# EAGLE design SevenSegmentDisplay (EAGLE 6.5.0)
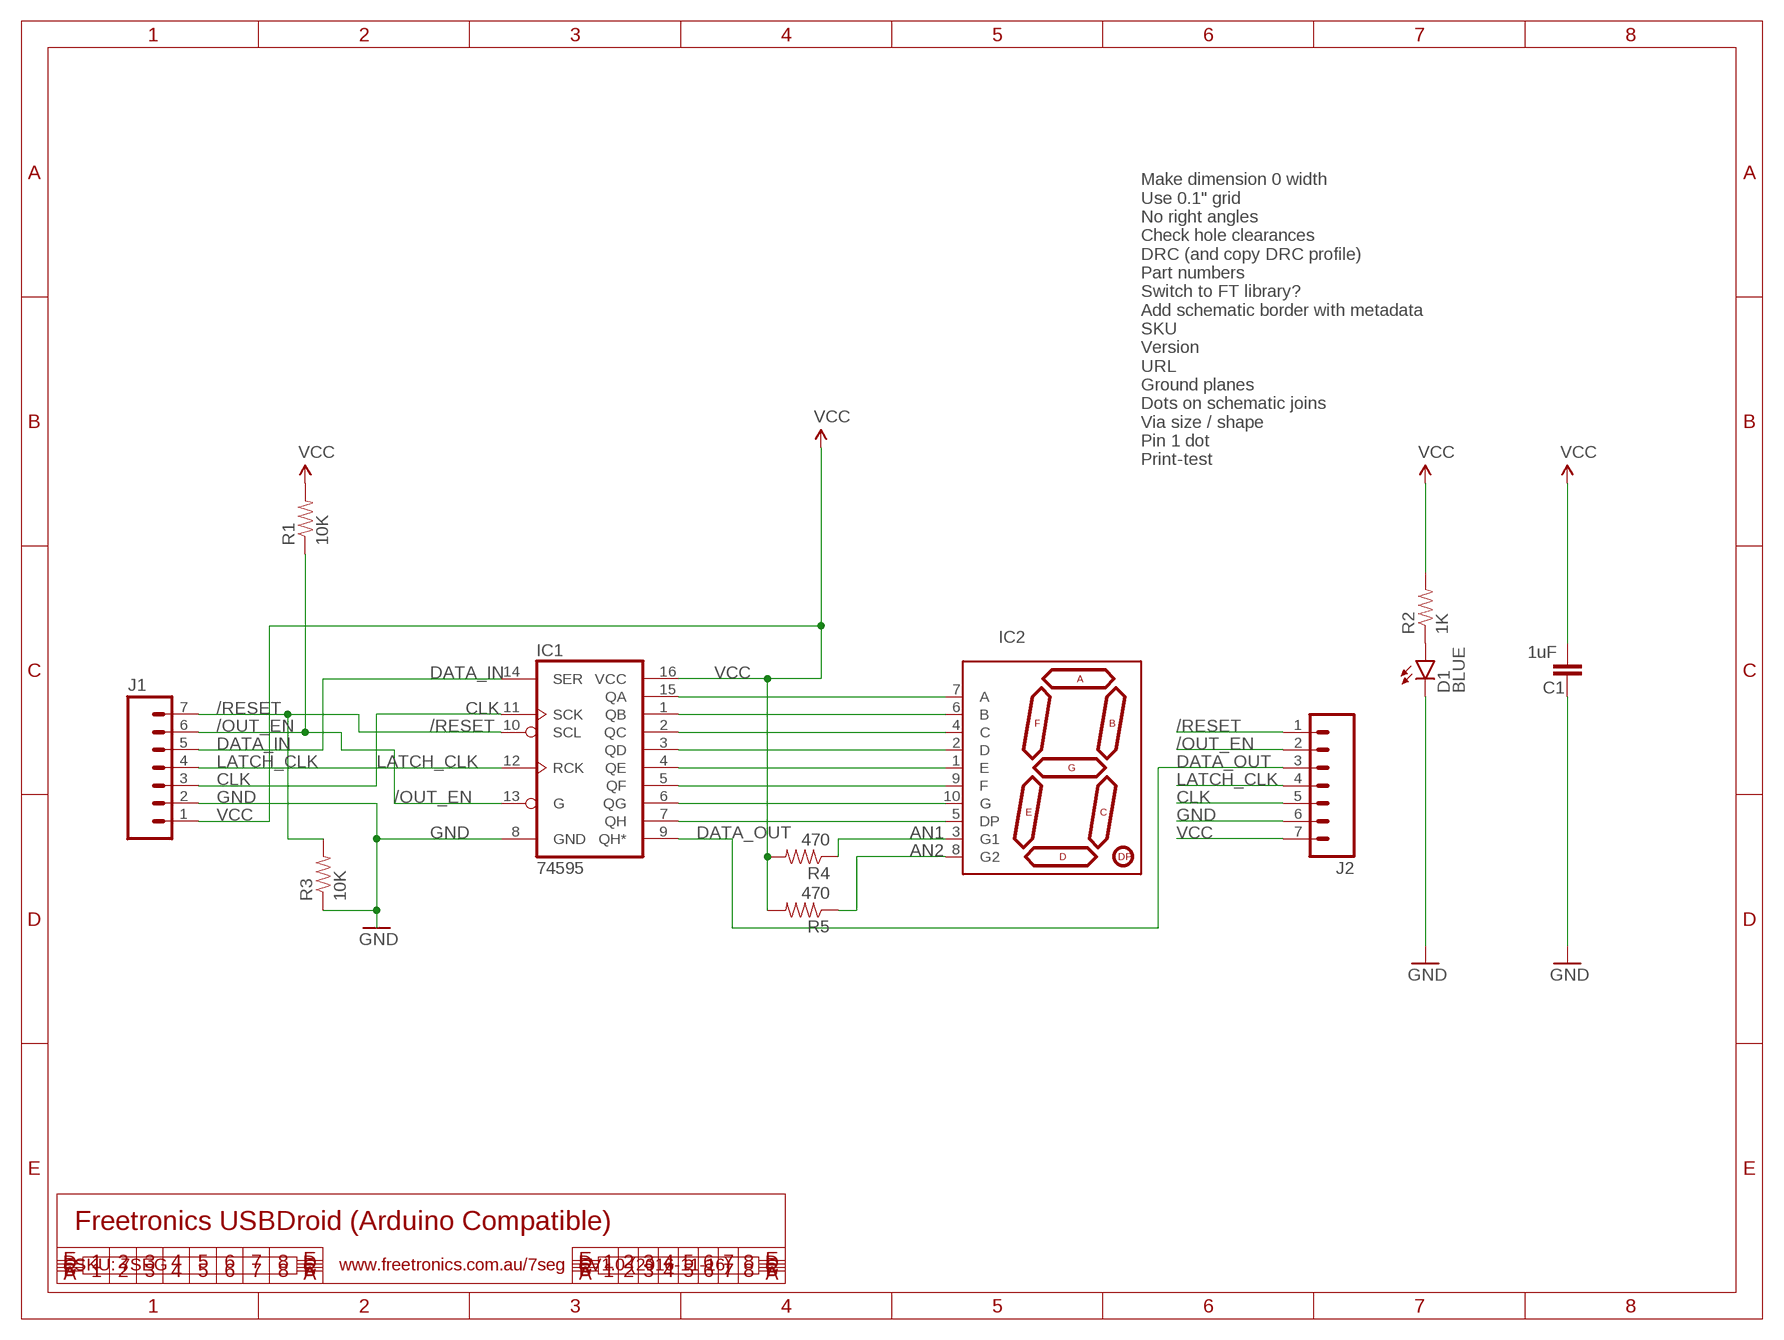
[diagram p0: schematic, sheet 1]

## Parts
C1  1uF  CAP0603-CAP  [0603-CAP]
D1  BLUE  LED-BLUE0603  [LED-0603]
IC1  74595  [TSSOP16]
IC2  7-SEGMENT-DISPLAYPTH  [7-SEGMENT-DISPLAY]
J1  M07  [1X07]
J2  M07  [1X07]
R1  10K  RESISTOR0603-RES  [0603-RES]
R2  1K  RESISTOR0603-RES  [0603-RES]
R3  10K  RESISTOR0603  [0603-RES]
R4  470  RESISTOR0603  [0603-RES]
R5  470  RESISTOR0603  [0603-RES]

## Nets
/OUT_EN: IC1.13(G) J1.6 J2.2 R1.1
/RESET: IC1.10(SCL) J1.7 J2.1 R3.2
AN1: IC2.3(G1) R4.1
AN2: IC2.8(G2) R5.1
CLK: IC1.11(SCK) J1.3 J2.5
DATA_IN: IC1.14(SER) J1.5
DATA_OUT: IC1.9(QH*) J2.3
GND: C1.1 D1.C IC1.8(GND) J1.2 J2.6 R3.1
LATCH_CLK: IC1.12(RCK) J1.4 J2.4
N$1: IC1.15(QA) IC2.7(A)
N$3: IC1.1(QB) IC2.6(B)
N$4: IC1.2(QC) IC2.4(C)
N$5: D1.A R2.1
N$6: IC1.3(QD) IC2.2(D)
N$7: IC1.4(QE) IC2.1(E)
N$8: IC1.5(QF) IC2.9(F)
N$9: IC1.6(QG) IC2.10(G)
N$10: IC1.7(QH) IC2.5(DP)
VCC: C1.2 IC1.16(VCC) J1.1 J2.7 R1.2 R2.2 R4.2 R5.2

## Notes on the sheet
- Make dimension 0 width
  Use 0.1" grid
  No right angles
  Check hole clearances
  DRC (and copy DRC profile)
  Part numbers
  Switch to FT library?
  Add schematic border with metadata
  SKU
  Version
  URL
  Ground planes
  Dots on schematic joins
  Via size / shape
  Pin 1 dot
  Print-test
- IC2
- Freetronics USBDroid (Arduino Compatible)
- SKU: 7SEG | www.freetronics.com.au/7seg | V1.0 (2016-11-16)

## Library data of the parts
C1 = SparkFun-Capacitors:CAP: Capacitor Standard 0603 ceramic capacitor, and 0.1" leaded capacitor.
D1 = SparkFun-LED:LED-BLUE: Blue LEDs for production use Various blue LEDs stocked by SparkFun production 0603 - DIO-08575 Rebel - DIO-09553 1206 - DIO-09911; PROD_ID: DIO-08575
IC1 = SparkFun-DigitalIC:74*595: 8-bit SHIFT REGISTER, output latch
IC2 = SparkFun-Displays:7-SEGMENT-DISPLAY
J1 J2 = SparkFun-Connectors:M07: Header 7 Standard 7-pin 0.1" header. Use with straight break away headers (SKU : PRT-00116), right angle break away headers (PRT-00553), swiss pins (PRT-00743), machine pins (PRT-00117), and female headers (PRT-00115). NOTES ON THE VARIANTS LOCK and LOCK_LONGPADS... This footprint was designed to help hold the alignment of a through-hole component (i.e. 7-pin header) while soldering it into place. You may notice that each hole has been shifted either up or down by 0.005 of an inch from it's more standard position (which is usually a perfectly straight line). This slight alteration caused the pins (the squares in the middle) to touch the edges of the holes. Because they are alternating, it causes a "brace" to hold the header in place. 0.005 has proven to be the perfect amount of "off-center" position when using our standard breakaway headers. Although looks a little odd when you look at the bare footprint, once you have a header in there, the alteration is very hard to notice. Also, if you push a header all the way into place, it is covered up entirely on the bottom side. This idea of altering the position of holes to aid alignment will be further integrated into the Sparkfun Library for other footprints. It can help hold any component with 3 or more connection pins.
R1 R2 = SparkFun-Passives:RESISTOR: Resistor Basic schematic elements and footprints for 0603, 1206, and PTH resistors.
R3-R5 = SparkFun-Resistors:RESISTOR: Resistor Basic schematic elements and footprints for 0603, 1206, and PTH resistors.

## Board
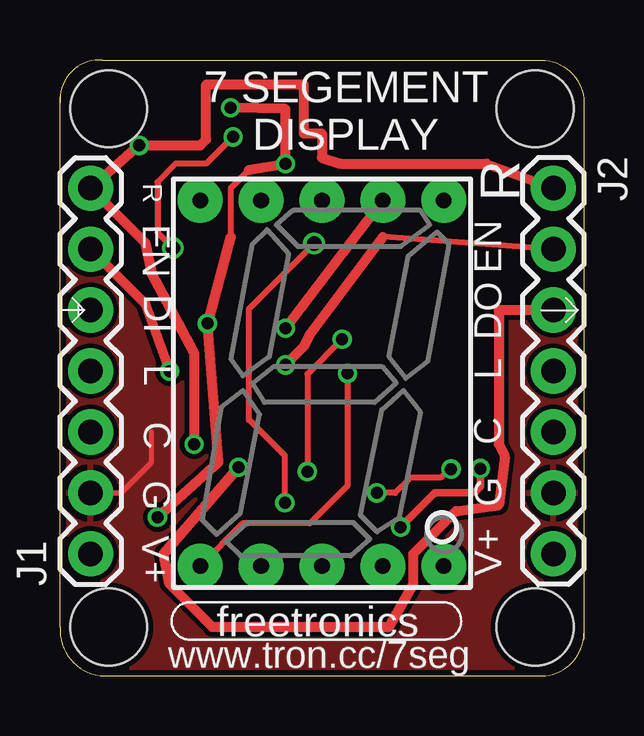
[diagram p1: board, top side]
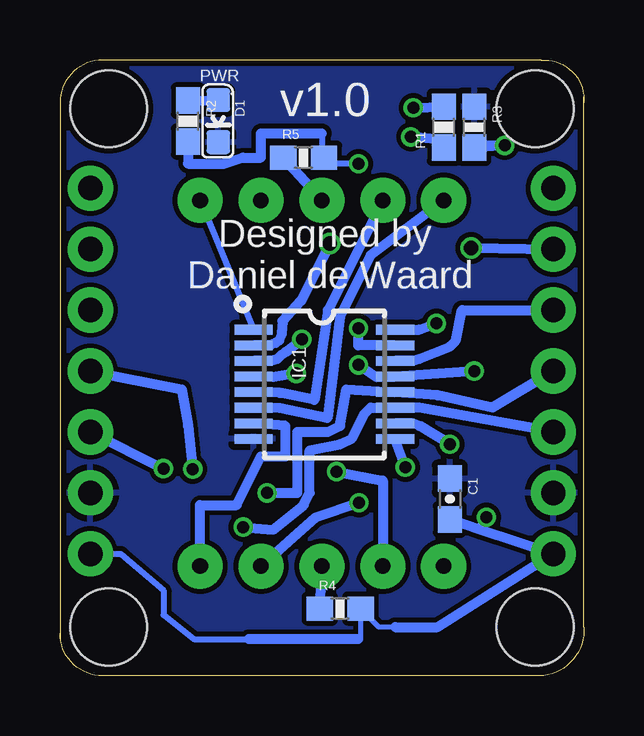
[diagram p2: board, bottom side, seen from below]

Size 21.85 x 25.66 mm. Coordinates in mm from the lower left corner, seen from the top.
Outline: 0,24.13 0,2.04 arc98 2.04,0 20.07,0 arc90 21.85,1.78
Outline: 21.85,1.53 21.85,23.88 arc90 20.07,25.66 1.78,25.66 arc99 0,23.88
Copper layers (1*16): Top 0.035mm / dielectric 1.5mm / Bottom 0.035mm
Design rules "dirt_cheap_dirty_boards.v1 *": minimum track width 5mil, minimum drill 12mil, track to track 8mil, track to pad 8mil, pad to pad 8mil, via to via 8mil, smd to smd 0mil, copper to edge 10mil, drill to drill 10mil, minimum pad ring 10mil, minimum via ring 6mil, stop-mask expansion 2mil, vias tented up to drill 25mil, thermal gap 10mil
Holes 3.2 mm at 2.04,2.04 19.82,2.04 2.04,23.63 19.82,23.63

### Footprints (pad centres in the part's own frame; a part is rotated, then mirrored left to right if it is on the bottom)
0603-CAP = smd 1.1 x 1: 1 -0.85,0; 2 0.85,0
LED-0603 = smd 1 x 1: A 0,-0.877; C 0,0.877
TSSOP16 = smd 0.4 x 1.6: 1 -2.225,-2.85; 2 -1.575,-2.85; 3 -0.925,-2.85; 4 -0.275,-2.85; 5 0.375,-2.85; 6 1.025,-2.85; 7 1.675,-2.85; 8 2.325,-2.85; 9 2.325,3.05; 10 1.675,3.05; 11 1.025,3.05; 12 0.375,3.05; 13 -0.275,3.05; 14 -0.925,3.05; 15 -1.575,3.05; 16 -2.225,3.05
7-SEGMENT-DISPLAY = drill 0.65 pad 1.88: 1 -5.08,-7.62; 2 -2.54,-7.62; 3 0,-7.62; 4 2.54,-7.62; 5 5.08,-7.62; 6 5.08,7.62; 7 2.54,7.62; 8 0,7.62; 9 -2.54,7.62; 10 -5.08,7.62
1X07 = drill 1.016 pad 1.88: 1 0,0; 2 2.54,0; 3 5.08,0; 4 7.62,0; 5 10.16,0; 6 12.7,0; 7 15.24,0
0603-RES = smd 1.1 x 1: 1 -0.85,0; 2 0.85,0

### Placement (x,y rotation side)
C1  5.59,7.37 270 bottom
D1  15.24,23.12 180 bottom
IC1  10.93,12.2 270 bottom
IC2  10.93,12.2 0 top
J1  1.27,5.08 90 top
J2  20.58,20.32 270 top
R1  5.85,22.86 90 bottom
R2  16.51,23.12 270 bottom
R3  4.58,22.86 270 bottom
R4  10.16,2.8 0 bottom
R5  11.69,21.59 0 bottom

### Tracks (layer width: path | path; a pad name or v marks a point on that pad's centre or on a via)
/OUT_EN  (via drill 0.5, 0.6)
  Top 0.254: J2.2 13.47,18.29 | v7.22,22.46 6.1,21.34 4.83,21.34 4.07,20.58 4.07,18.47 v4.7,17.83
  Top 0.406: J1.6 3.56,15.5 v4.58,12.7 | 13.47,18.29 10.42,14.23 10.16,13.72 v9.4,12.96
  Bottom 0.406: v4.58,12.7 IC1.13 8.64,12.45 v9.4,12.96 | R1.1 6.19,22.36 v7.22,22.46 | v4.7,17.83 J1.6
/RESET  (via drill 0.5)
  Top 0.406: v5.59,9.66 5.59,13.47 3.81,16.77 3.56,18.04 J1.7 v3.31,22.1 5.85,22.1 6.1,22.36 6.1,24.64 10.16,24.64 10.16,22.61 10.93,22.61 10.93,21.59 11.69,21.34 17.78,21.34 J2.1
  Bottom 0.406: v5.59,9.66 6.86,10.42 7.14,10.52 IC1.10 | v3.31,22.1 R3.2 4.58,22.1 v3.31,22.1
AN1
  Bottom 0.406: R4.1 IC2.3
AN2
  Bottom 0.406: IC2.8 R5.1
CLK  (via drill 0.5)
  Top 0.305: v17.53,8.64 17.53,7.88 17.28,7.62 15.63,7.62 v14.2,6.2
  Bottom 0.406: J1.3 6.86,11.18 IC1.11 8.89,11.18 9.15,10.93 9.66,9.91 10.16,9.66 11.43,9.4 11.43,7.62 11.69,7.12 12.96,6.1 v14.2,6.2 | J2.5 v17.53,8.64
DATA_IN
  Bottom 0.406: J1.5 5.08,15.24 5.34,13.97 5.59,13.72 6.86,13.21 7.12,13.14 IC1.14
DATA_OUT  (via drill 0.5)
  Top 0.406: v7.45,8.69 4.32,5.08 4.58,3.81 6.35,2.04 13.72,2.04 14.74,3.81 14.74,5.08 16.51,6.86 18.29,7.12 18.55,9.15 18.29,9.66 18.29,15.24 J2.3
  Bottom 0.406: v7.45,8.69 IC1.9
GND
  Top 0.203: J1.2 2.54,7.62 3.81,8.89 3.81,10.16
  pour Bottom: 0,26.67 0,0 22.86,0 22.86,26.67
  pour Top: 0,26.67 0,0 22.86,0 22.86,26.67
LATCH_CLK  (via drill 0.5)
  Top 0.254: v16.31,8.61 16.24,8.61 15.88,8.26 14.61,8.26 13.97,7.62 v13.21,7.62
  Bottom 0.406: J1.4 3.81,11.18 6.1,11.69 IC1.12 9.91,11.94 10.16,10.42 10.67,10.16 11.94,10.16 11.94,7.62 v13.21,7.62 | J2.4 16.77,11.94 16.51,10.42 v16.31,8.61
N$1  (via drill 0.5)
  Top 0.406: v9.4,14.48 IC2.7
  Bottom 0.406: IC1.15 9.4,13.77 v9.4,14.48
N$3
  Bottom 0.254: IC2.6 IC1.1
N$4  (via drill 0.5, 0.6)
  Top 0.254: v9.38,7.22 9.38,9.17 7.88,10.67 7.88,15.29 v10.6,18.01
  Bottom 0.406: IC2.4 11.18,6.61 v9.38,7.22 | v10.6,18.01 11.79,15.62 12.58,14.79 12.6,14.25 12.7,13.97 12.86,13.87 13.06,13.8 IC1.2
N$5
  Bottom 0.406: R2.1 D1.A
N$6  (via drill 0.5)
  Top 0.254: v11.76,14.02 10.32,12.58 v10.32,8.51
  Bottom 0.406: v10.32,8.51 8.39,8.13 IC2.2 | IC1.3 13.06,13.14 12.78,13.21 12.63,13.36 12.45,13.49 v11.76,14.02
N$7  (via drill 0.5)
  Top 0.254: v11.99,12.6 11.99,7.93 10.42,6.35 7.62,6.35 IC2.1
  Bottom 0.406: v11.99,12.6 12.96,12.45 IC1.4
N$8
  Bottom 0.406: IC2.9 10.67,15.24 11.24,11.5 12.68,11.79 IC1.5
N$9
  Bottom 0.406: IC2.10 8.89,17.53 10.16,14.99 10.7,10.74 12.68,11.15 IC1.6
N$10
  Bottom 0.406: IC1.7 12.45,10.42 12.45,9.15 13.47,9.15 14.48,7.12 16.01,7.12 IC2.5
VCC  (via drill 0.5)
  Top 0.254: 7.12,18.29 7.12,20.32 7.88,21.09
  Top 0.406: v4.07,6.61 6.61,8.89 v6.15,14.68 7.12,18.29 | 7.88,21.09 v9.4,21.34 9.4,23.63 v7.12,23.68
  Bottom 0.203: 9.4,1.53 9.31,1.62 R4.2 8.55,2.04 7.88,2.04
  Bottom 0.254: 10.93,22.61 10.93,21.68 R5.2 10.58,21.34 v9.4,21.34 | J2.7 19.31,5.08 17.53,3.56 17.53,2.54 16.26,1.53 13.97,1.53
  Bottom 0.406: R2.2 16.51,21.34 14.99,21.34 14.23,21.59 13.47,21.59 13.47,22.61 10.93,22.61 | 4.32,6.1 J1.1 6.1,2.04 7.88,2.04 | 9.4,1.53 13.97,1.53 | 4.32,6.1 C1.2 5.59,6.61 | 4.32,6.1 v4.07,6.61 | v7.12,23.68 R1.2 | IC1.16 6.86,14.43 v6.15,14.68

### Text on the board
tPlace: 7 SEGEMENT / DISPLAY | R | R | EN | EN | DI | DO | L | L | C | C | G | G | V+ | V+ | freetronics | www.tron.cc/7seg
bPlace: PWR | v1.0 | Designed by / Daniel de Waard